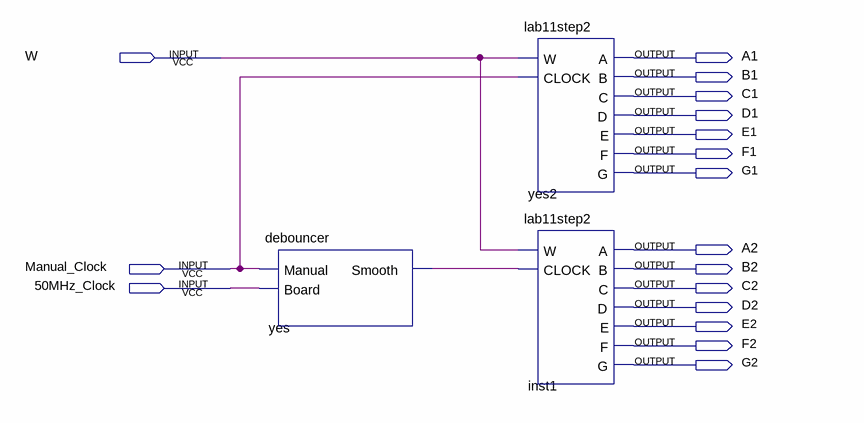
[diagram p0: schematic sheet]
// Quartus schematic lab11step3.bdf as structural Verilog: 3 symbols, 17 pins
module lab11step3 (
  input  W,
  input  Manual_Clock,
  input  \50MHz_Clock ,
  output A1,
  output B1,
  output C1,
  output D1,
  output E1,
  output F1,
  output G1,
  output A2,
  output B2,
  output C2,
  output D2,
  output E2,
  output F2,
  output G2
);

  wire yes_smooth;

  debouncer yes (.Manual(Manual_Clock), .Board(\50MHz_Clock ), .Smooth(yes_smooth));
  lab11step2 yes2 (.W(W), .CLOCK(Manual_Clock), .A(A1), .B(B1), .C(C1), .D(D1), .E(E1), .F(F1), .G(G1));
  lab11step2 inst1 (.W(W), .CLOCK(yes_smooth), .A(A2), .B(B2), .C(C2), .D(D2), .E(E2), .F(F2), .G(G2));
endmodule
